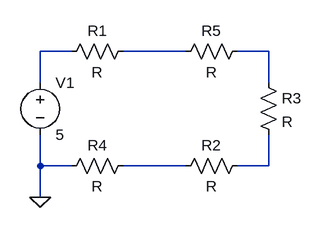
[diagram p0: schematic Draft1.asc]
Draft1.asc, the LTspice schematic file:
Version 4
SHEET 1 880 680
WIRE 144 80 96 80
WIRE 320 80 224 80
WIRE 448 80 400 80
WIRE 96 128 96 80
WIRE 448 128 448 80
WIRE 96 256 96 208
WIRE 144 256 96 256
WIRE 320 256 224 256
WIRE 448 256 448 208
WIRE 448 256 400 256
WIRE 96 304 96 256
FLAG 96 304 0
SYMBOL voltage 96 112 R0
WINDOW 123 0 0 Left 0
WINDOW 39 0 0 Left 0
SYMATTR InstName V1
SYMATTR Value 5
SYMBOL res 240 64 R90
WINDOW 0 0 56 VBottom 2
WINDOW 3 32 56 VTop 2
SYMATTR InstName R1
SYMBOL res 432 112 R0
SYMATTR InstName R3
SYMBOL res 240 240 R90
WINDOW 0 0 56 VBottom 2
WINDOW 3 32 56 VTop 2
SYMATTR InstName R4
SYMBOL res 416 240 R90
WINDOW 0 0 56 VBottom 2
WINDOW 3 32 56 VTop 2
SYMATTR InstName R2
SYMBOL res 416 64 R90
WINDOW 0 0 56 VBottom 2
WINDOW 3 32 56 VTop 2
SYMATTR InstName R5

The netlist it stands for:
* Draft1.asc
V1 N001 0 5
R1 N002 N001 R
R3 N003 N005 R
R4 N004 0 R
R2 N005 N004 R
R5 N003 N002 R
.backanno
.end